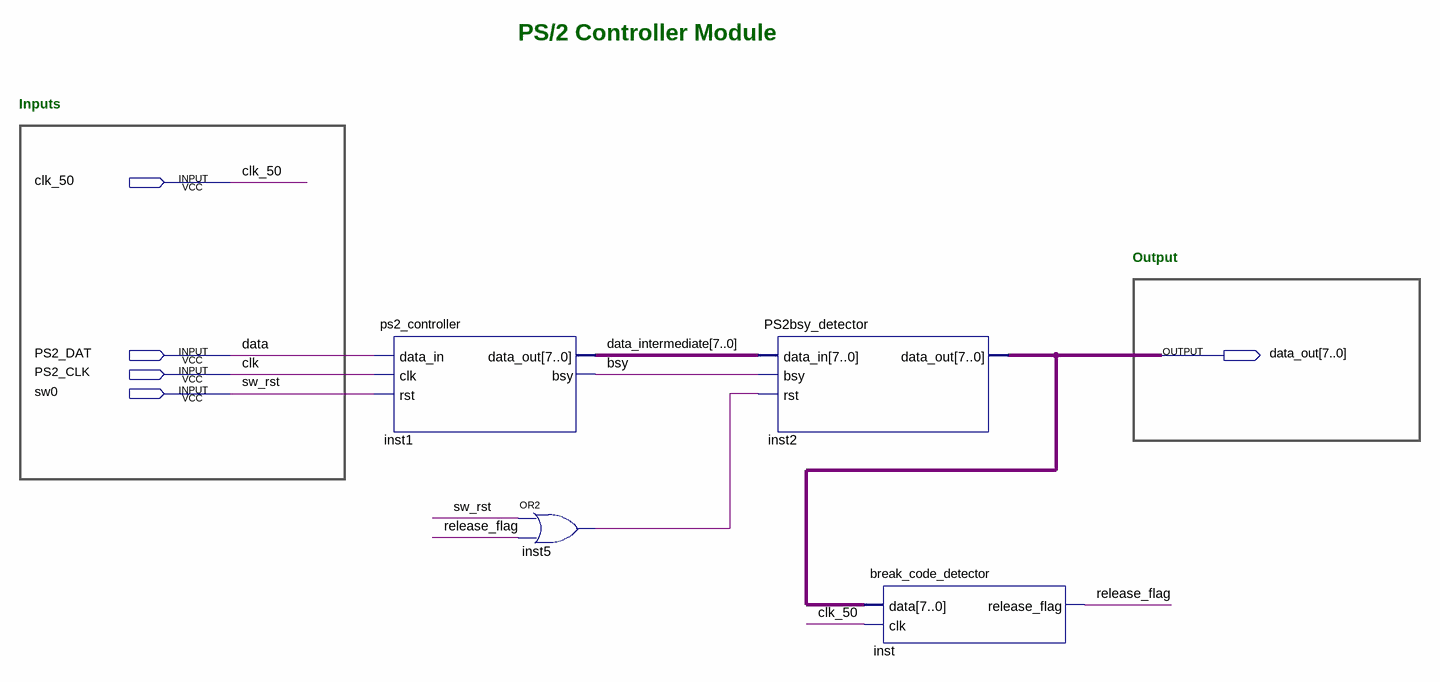
[diagram p0: schematic sheet]
// Quartus schematic PS2controller.bdf as structural Verilog: 4 symbols, 5 pins
module PS2controller (
  input  clk_50,
  input  PS2_DAT,
  input  PS2_CLK,
  input  sw0,
  output [7:0] data_out
);

  wire bsy, inst5_out, release_flag;
  wire [7:0] data_intermediate;

  ps2_controller inst1 (.data_in(PS2_DAT), .clk(PS2_CLK), .rst(sw0), .data_out(data_intermediate), .bsy(bsy));
  or inst5 (inst5_out, sw0, release_flag);
  PS2bsy_detector inst2 (.data_in(data_intermediate), .bsy(bsy), .rst(inst5_out), .data_out(data_out));
  break_code_detector inst (.data(data_out), .clk(clk_50), .release_flag(release_flag));

  // Other names for the same wires on the sheet: clk = PS2_CLK; data = PS2_DAT; sw_rst = sw0

  // Notes on the sheet:
  //   PS/2 Controller Module
  //   Inputs
  //   Output
endmodule
